# EAGLE schematic Panel Posterior (EAGLE 9.6.2)
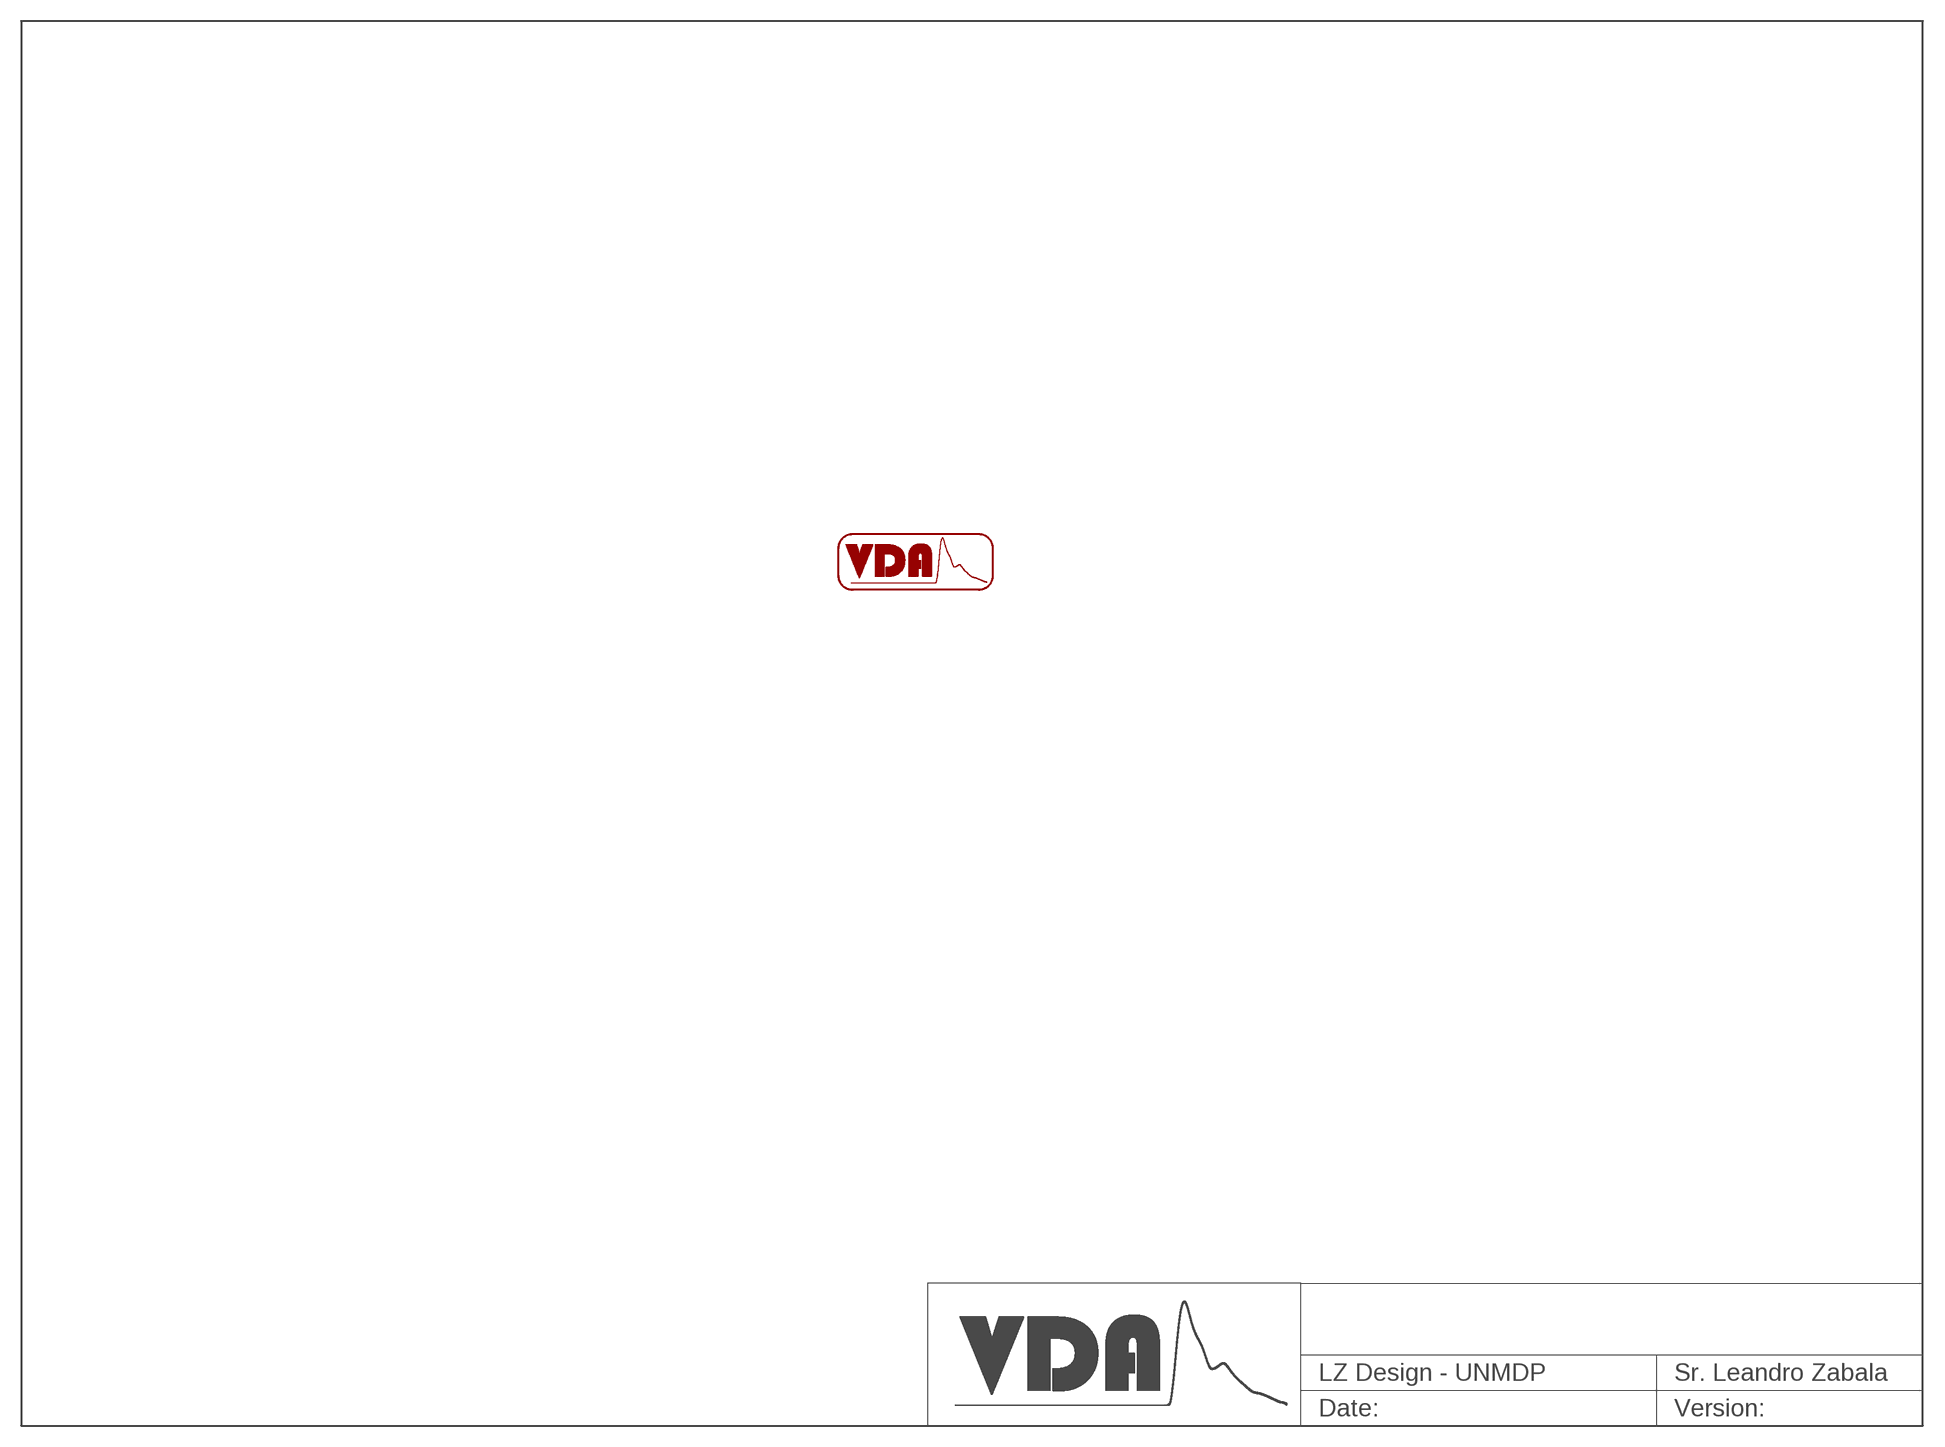
[diagram p0: schematic, sheet 1]

## Parts
U$2  LOGO_VDA-3CM  [LOGO_VDA-3CM]

## Library data of the parts
U$2 = Frames:LOGO_VDA